# EAGLE schematic nitwhips_v1.0 (EAGLE 5.11)
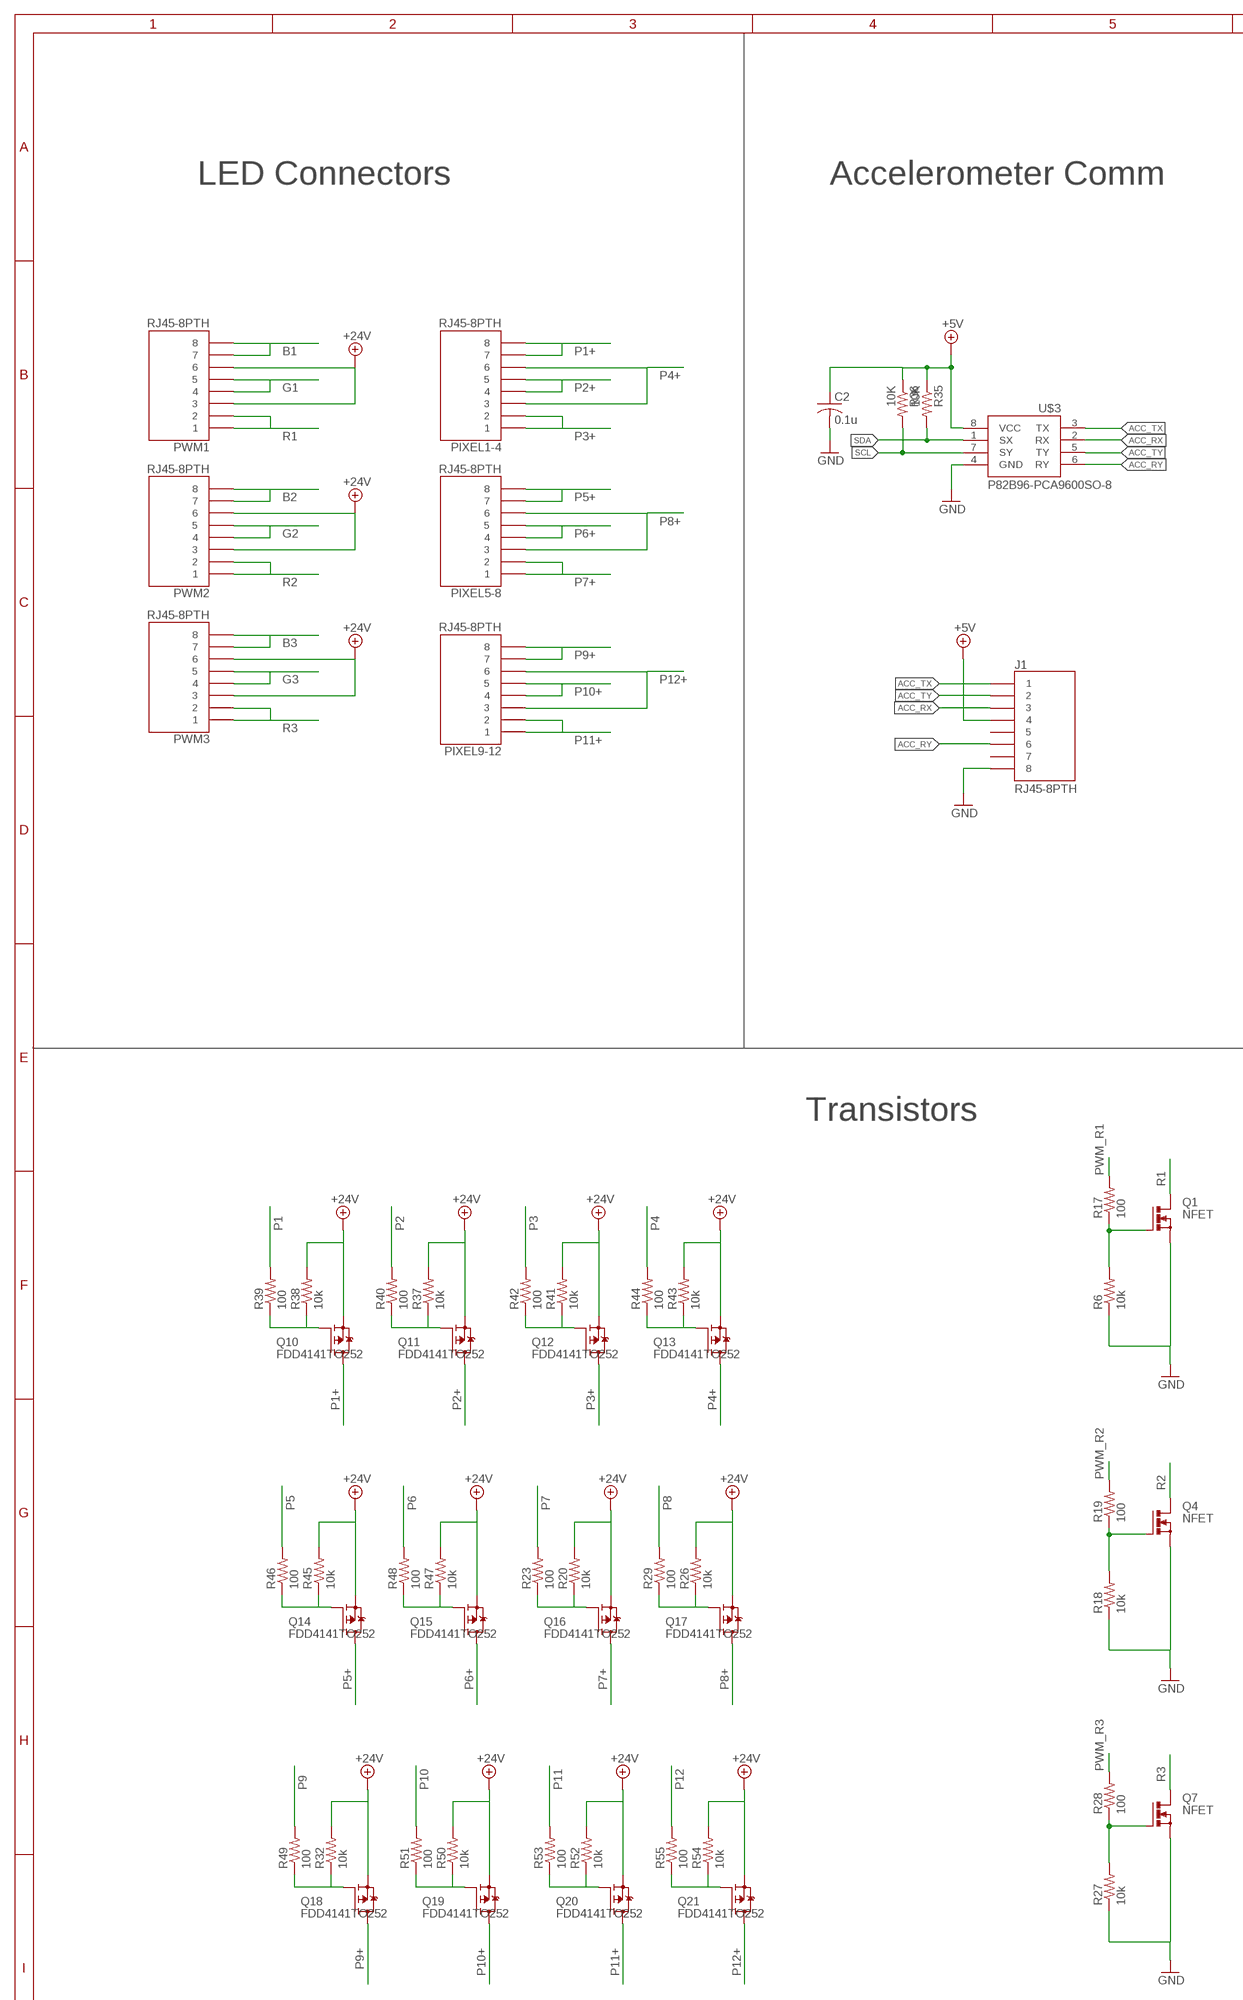
[diagram p0: schematic, sheet 1, part 1 of 2]
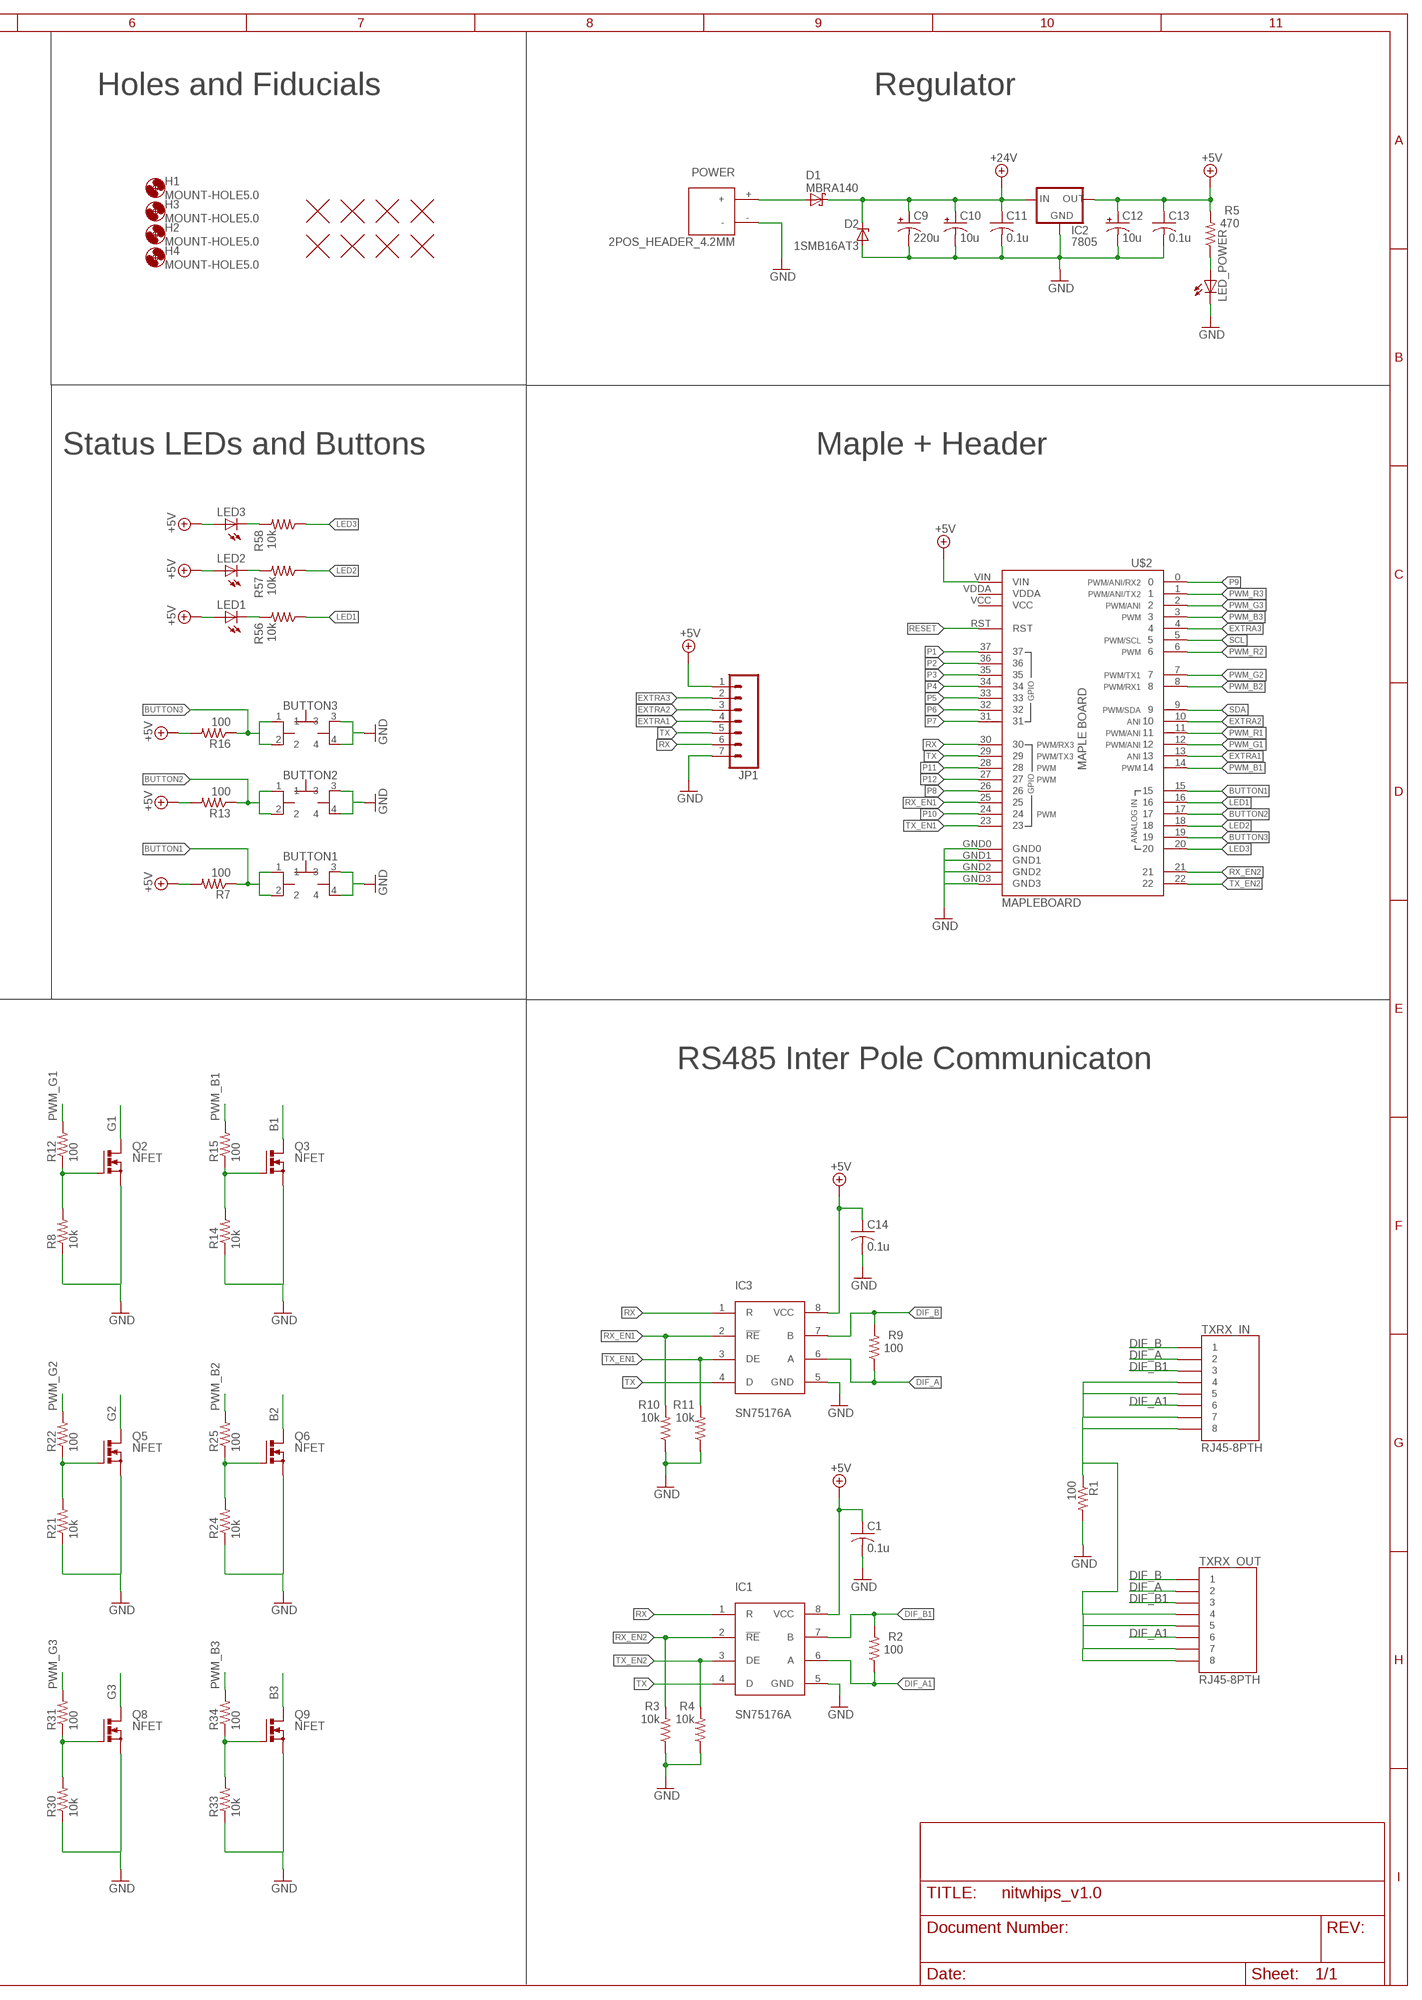
[diagram p1: schematic, sheet 1, part 2 of 2]

## Parts
BUTTON1  TL3301  [TL3301]
BUTTON2  TL3301  [TL3301]
BUTTON3  TL3301  [TL3301]
C1  0.1u  C-USC0805  [C0805]
C2  0.1u  C-USC0805  [C0805]
C9  220u  CPOL-USG  [PANASONIC_G]
C10  10u  CPOL-USCT6032  [CT6032]
C11  0.1u  C-USC0805  [C0805]
C12  10u  CPOL-USCT6032  [CT6032]
C13  0.1u  C-USC0805  [C0805]
C14  0.1u  C-USC0805  [C0805]
D1  MBRA140  [SMA]
D2  1SMB16AT3  ZENER-DIODESMB  [SMB]
H1  MOUNT-HOLE5.0  [5,0]
H2  MOUNT-HOLE5.0  [5,0]
H3  MOUNT-HOLE5.0  [5,0]
H4  MOUNT-HOLE5.0  [5,0]
IC1  SN75176A  [SO-08]
IC2  7805  LP2950CDT-5.0  [DPACK]
IC3  SN75176A  [SO-08]
J1  RJ45-8PTH  [RJ45-8]
JP1  M07  [1X07]
LED1  LEDCHIP-LED0805  [CHIP-LED0805]
LED2  LEDCHIP-LED0805  [CHIP-LED0805]
LED3  LEDCHIP-LED0805  [CHIP-LED0805]
LED_POWER  LEDCHIP-LED0805  [CHIP-LED0805]
PIXEL1-4  RJ45-8PTH  [RJ45-8]
PIXEL5-8  RJ45-8PTH  [RJ45-8]
PIXEL9-12  RJ45-8PTH  [RJ45-8]
POWER  2POS_HEADER_4.2MM  [2POS_HEADER_4.2MM]
PWM1  RJ45-8PTH  [RJ45-8]
PWM2  RJ45-8PTH  [RJ45-8]
PWM3  RJ45-8PTH  [RJ45-8]
Q1  NFET  [TO252]
Q2  NFET  [TO252]
Q3  NFET  [TO252]
Q4  NFET  [TO252]
Q5  NFET  [TO252]
Q6  NFET  [TO252]
Q7  NFET  [TO252]
Q8  NFET  [TO252]
Q9  NFET  [TO252]
Q10  FDD4141TO252  [TO252]
Q11  FDD4141TO252  [TO252]
Q12  FDD4141TO252  [TO252]
Q13  FDD4141TO252  [TO252]
Q14  FDD4141TO252  [TO252]
Q15  FDD4141TO252  [TO252]
Q16  FDD4141TO252  [TO252]
Q17  FDD4141TO252  [TO252]
Q18  FDD4141TO252  [TO252]
Q19  FDD4141TO252  [TO252]
Q20  FDD4141TO252  [TO252]
Q21  FDD4141TO252  [TO252]
R1  100  R-US_R2512  [R2512]
R2  100  R-US_R0805  [R0805]
R3  10k  R-US_R0805  [R0805]
R4  10k  R-US_R0805  [R0805]
R5  470  R-US_R0805  [R0805]
R6  10k  R-US_R0603  [R0603]
R7  100  R-US_R0603  [R0603]
R8  10k  R-US_R0603  [R0603]
R9  100  R-US_R0805  [R0805]
R10  10k  R-US_R0805  [R0805]
R11  10k  R-US_R0805  [R0805]
R12  100  R-US_R0603  [R0603]
R13  100  R-US_R0603  [R0603]
R14  10k  R-US_R0603  [R0603]
R15  100  R-US_R0603  [R0603]
R16  100  R-US_R0603  [R0603]
R17  100  R-US_R0603  [R0603]
R18  10k  R-US_R0603  [R0603]
R19  100  R-US_R0603  [R0603]
R20  10k  R-US_R0603  [R0603]
R21  10k  R-US_R0603  [R0603]
R22  100  R-US_R0603  [R0603]
R23  100  R-US_R0603  [R0603]
R24  10k  R-US_R0603  [R0603]
R25  100  R-US_R0603  [R0603]
R26  10k  R-US_R0603  [R0603]
R27  10k  R-US_R0603  [R0603]
R28  100  R-US_R0603  [R0603]
R29  100  R-US_R0603  [R0603]
R30  10k  R-US_R0603  [R0603]
R31  100  R-US_R0603  [R0603]
R32  10k  R-US_R0603  [R0603]
R33  10k  R-US_R0603  [R0603]
R34  100  R-US_R0603  [R0603]
R35  10K  R-US_R0603  [R0603]
R36  10K  R-US_R0603  [R0603]
R37  10k  R-US_R0603  [R0603]
R38  10k  R-US_R0603  [R0603]
R39  100  R-US_R0603  [R0603]
R40  100  R-US_R0603  [R0603]
R41  10k  R-US_R0603  [R0603]
R42  100  R-US_R0603  [R0603]
R43  10k  R-US_R0603  [R0603]
R44  100  R-US_R0603  [R0603]
R45  10k  R-US_R0603  [R0603]
R46  100  R-US_R0603  [R0603]
R47  10k  R-US_R0603  [R0603]
R48  100  R-US_R0603  [R0603]
R49  100  R-US_R0603  [R0603]
R50  10k  R-US_R0603  [R0603]
R51  100  R-US_R0603  [R0603]
R52  10k  R-US_R0603  [R0603]
R53  100  R-US_R0603  [R0603]
R54  10k  R-US_R0603  [R0603]
R55  100  R-US_R0603  [R0603]
R56  10k  R-US_R0805  [R0805]
R57  10k  R-US_R0805  [R0805]
R58  10k  R-US_R0805  [R0805]
TXRX_IN  RJ45-8PTH  [RJ45-8]
TXRX_OUT  RJ45-8PTH  [RJ45-8]
U$1  FIDUCIAL1X2  [FIDUCIAL-1X2]
U$2  MAPLEBOARD  [MAPLEBOARD]
U$3  P82B96-PCA9600SO-8  [SO-8]
U$4  FIDUCIAL1X2  [FIDUCIAL-1X2]
U$5  FIDUCIAL1X2  [FIDUCIAL-1X2]
U$6  FIDUCIAL1X2  [FIDUCIAL-1X2]
U$7  FIDUCIAL1X2  [FIDUCIAL-1X2]
U$8  FIDUCIAL1X2  [FIDUCIAL-1X2]
U$9  FIDUCIAL1X2  [FIDUCIAL-1X2]
U$10  FIDUCIAL1X2  [FIDUCIAL-1X2]

## Nets
+5V: C1.1 C2.1 C12.+ C13.1 C14.1 IC1.8(VCC) IC2.3(OUT) IC3.8(VCC) J1.4 JP1.1 LED1.A LED2.A LED3.A R5.2 R7.2 R13.2 R16.2 R35.1 R36.1 U$2.VIN U$3.8(VCC)
+24V: C9.+ C10.+ C11.1 D1.K(C) D2.C IC2.1(IN) PWM1.3 PWM1.6 PWM2.3 PWM2.6 PWM3.3 PWM3.6 Q10.S Q11.S Q12.S Q13.S Q14.S Q15.S Q16.S Q17.S Q18.S Q19.S Q20.S Q21.S R20.2 R26.2 R32.2 R37.2 R38.2 R41.2 R43.2 R45.2 R47.2 R50.2 R52.2 R54.2
ACC_RX: J1.3 U$3.2(RX)
ACC_RY: J1.6 U$3.6(RY)
ACC_TX: J1.1 U$3.3(TX)
ACC_TY: J1.2 U$3.5(TY)
B1: PWM1.7 PWM1.8 Q3.2(D)
B2: PWM2.7 PWM2.8 Q6.2(D)
B3: PWM3.7 PWM3.8 Q9.2(D)
BUTTON1: BUTTON1.1 BUTTON1.2 R7.1 U$2.15
BUTTON2: BUTTON2.1 BUTTON2.2 R13.1 U$2.17
BUTTON3: BUTTON3.1 BUTTON3.2 R16.1 U$2.19
DIF_A: IC3.6(A) R9.1 TXRX_IN.2 TXRX_OUT.2
DIF_A1: IC1.6(A) R2.1 TXRX_IN.6 TXRX_OUT.6
DIF_B: IC3.7(B) R9.2 TXRX_IN.1 TXRX_OUT.1
DIF_B1: IC1.7(B) R2.2 TXRX_IN.3 TXRX_OUT.3
EXTRA1: JP1.4 U$2.13
EXTRA2: JP1.3 U$2.10
EXTRA3: JP1.2 U$2.4
G1: PWM1.4 PWM1.5 Q2.2(D)
G2: PWM2.4 PWM2.5 Q5.2(D)
G3: PWM3.4 PWM3.5 Q8.2(D)
GND: BUTTON1.3 BUTTON1.4 BUTTON2.3 BUTTON2.4 BUTTON3.3 BUTTON3.4 C1.2 C2.2 C9.- C10.- C11.2 C12.- C13.2 C14.2 D2.A IC1.5(GND) IC2.4(GND) IC3.5(GND) J1.8 JP1.7 LED_POWER.C POWER.- Q1.3(S) Q2.3(S) Q3.3(S) Q4.3(S) Q5.3(S) Q6.3(S) Q7.3(S) Q8.3(S) Q9.3(S) R1.2 R3.1 R4.1 R6.1 R8.1 R10.1 R11.1 R14.1 R18.1 R21.1 R24.1 R27.1 R30.1 R33.1 U$2.GND0 U$2.GND1 U$2.GND2 U$2.GND3 U$3.4(GND)
LED1: R56.1 U$2.16
LED2: R57.1 U$2.18
LED3: R58.1 U$2.20
N$1: LED_POWER.A R5.1
N$2: Q2.1(G) R8.2 R12.1
N$3: Q18.G R32.1 R49.1
N$4: R1.1 TXRX_IN.4 TXRX_IN.5 TXRX_IN.7 TXRX_IN.8 TXRX_OUT.4 TXRX_OUT.5 TXRX_OUT.7 TXRX_OUT.8
N$5: D1.A POWER.+
N$6: Q19.G R50.1 R51.1
N$8: Q3.1(G) R14.2 R15.1
N$9: Q20.G R52.1 R53.1
N$10: Q4.1(G) R18.2 R19.1
N$11: LED1.C R56.2
N$12: Q5.1(G) R21.2 R22.1
N$13: Q16.G R20.1 R23.1
N$14: Q6.1(G) R24.2 R25.1
N$15: Q17.G R26.1 R29.1
N$16: Q7.1(G) R27.2 R28.1
N$17: Q21.G R54.1 R55.1
N$18: Q8.1(G) R30.2 R31.1
N$19: Q1.1(G) R6.2 R17.1
N$20: LED2.C R57.2
N$21: Q9.1(G) R33.2 R34.1
N$22: Q11.G R37.1 R40.1
N$23: Q12.G R41.1 R42.1
N$24: Q10.G R38.1 R39.1
N$25: Q13.G R43.1 R44.1
N$26: Q14.G R45.1 R46.1
N$27: Q15.G R47.1 R48.1
N$28: LED3.C R58.2
P1: R39.2 U$2.37
P1+: PIXEL1-4.7 PIXEL1-4.8 Q10.D
P2: R40.2 U$2.36
P2+: PIXEL1-4.4 PIXEL1-4.5 Q11.D
P3: R42.2 U$2.35
P3+: PIXEL1-4.1 PIXEL1-4.2 Q12.D
P4: R44.2 U$2.34
P4+: PIXEL1-4.3 PIXEL1-4.6 Q13.D
P5: R46.2 U$2.33
P5+: PIXEL5-8.7 PIXEL5-8.8 Q14.D
P6: R48.2 U$2.32
P6+: PIXEL5-8.4 PIXEL5-8.5 Q15.D
P7: R23.2 U$2.31
P7+: PIXEL5-8.1 PIXEL5-8.2 Q16.D
P8: R29.2 U$2.26
P8+: PIXEL5-8.3 PIXEL5-8.6 Q17.D
P9: R49.2 U$2.0
P9+: PIXEL9-12.7 PIXEL9-12.8 Q18.D
P10: R51.2 U$2.24
P10+: PIXEL9-12.4 PIXEL9-12.5 Q19.D
P11: R53.2 U$2.28
P11+: PIXEL9-12.1 PIXEL9-12.2 Q20.D
P12: R55.2 U$2.27
P12+: PIXEL9-12.3 PIXEL9-12.6 Q21.D
PWM_B1: R15.2 U$2.14
PWM_B2: R25.2 U$2.8
PWM_B3: R34.2 U$2.3
PWM_G1: R12.2 U$2.12
PWM_G2: R22.2 U$2.7
PWM_G3: R31.2 U$2.2
PWM_R1: R17.2 U$2.11
PWM_R2: R19.2 U$2.6
PWM_R3: R28.2 U$2.1
R1: PWM1.1 PWM1.2 Q1.2(D)
R2: PWM2.1 PWM2.2 Q4.2(D)
R3: PWM3.1 PWM3.2 Q7.2(D)
RESET: U$2.RST
RX: IC1.1(R) IC3.1(R) JP1.6 U$2.30
RX_EN1: IC3.2(!RE) R10.2 U$2.25
RX_EN2: IC1.2(!RE) R3.2 U$2.21
SCL: R36.2 U$2.5 U$3.7(SY)
SDA: R35.2 U$2.9 U$3.1(SX)
TX: IC1.4(D) IC3.4(D) JP1.5 U$2.29
TX_EN1: IC3.3(DE) R11.2 U$2.23
TX_EN2: IC1.3(DE) R4.2 U$2.22
Unconnected: J1.5 J1.7 U$2.VCC U$2.VDDA

## Notes on the sheet
- Holes and Fiducials | Regulator
- LED Connectors | Accelerometer Comm
- Status LEDs and Buttons | Maple + Header
- Transistors | RS485 Inter Pole Communicaton

## Library data of the parts
BUTTON1-BUTTON3 = E-switch:TL3301
C1 C2 C11 C13 C14 = rcl:C-US: CAPACITOR, American symbol
C9 C10 C12 = rcl:CPOL-US: POLARIZED CAPACITOR, American symbol
D1 = diode:MBRA140
D2 = diode:ZENER-DIODE: Z-Diode
H1-H4 = holes:MOUNT-HOLE: MOUNTING HOLE with drill center marker
IC1 IC3 = texas:SN75176A: Transceiver RS422
IC2 = v-reg:LP2950?*: Source: http://cache.national.com/ds/LP/LP2950.pdf
J1 PIXEL1-4 PIXEL5-8 PIXEL9-12 PWM1-PWM3 TXRX_IN TXRX_OUT = SparkFun:RJ45-8: RJ45 Jack Simple RJ45, 8-pin connection - connector for common Cat5, Cat5e, and Cat6 Ethernet cables. Footprint not yet proven in production. Connector sku is PRT-00643; Breakout PCB sku is BOB-00716.
JP1 = SparkFun:M07: Header 7 Standard 7-pin 0.1" header. Use with straight break away headers (SKU : PRT-00116), right angle break away headers (PRT-00553), swiss pins (PRT-00743), machine pins (PRT-00117), and female headers (PRT-00115). NOTES ON THE VARIANTS LOCK and LOCK_LONGPADS... This footprint was designed to help hold the alignment of a through-hole component (i.e. 7-pin header) while soldering it into place. You may notice that each hole has been shifted either up or down by 0.005 of an inch from it's more standard position (which is usually a perfectly straight line). This slight alteration caused the pins (the squares in the middle) to touch the edges of the holes. Because they are alternating, it causes a "brace" to hold the header in place. 0.005 has proven to be the perfect amount of "off-center" position when using our standard breakaway headers. Although looks a little odd when you look at the bare footprint, once you have a header in there, the alteration is very hard to notice. Also, if you push a header all the way into place, it is covered up entirely on the bottom side. This idea of altering the position of holes to aid alignment will be further integrated into the Sparkfun Library for other footprints. It can help hold any component with 3 or more connection pins.
LED1-LED3 LED_POWER = led:LED: LED OSRAM: - CHIPLED LG R971, LG N971, LY N971, LG Q971, LY Q971, LO R971, LY R971 LH N974, LH R974 LS Q976, LO Q976, LY Q976 LO Q996 - Hyper CHIPLED LW Q18S LB Q993, LB Q99A, LB R99A - SideLED LS A670, LO A670, LY A670, LG A670, LP A670 LB A673, LV A673, LT A673, LW A673 LH A674 LY A675 LS A676, LA A676, LO A676, LY A676, LW A676 LS A679, LY A679, LG A679 - Hyper Micro SIDELED® LS Y876, LA Y876, LO Y876, LY Y876 LT Y87S - SmartLED LW L88C, LW L88S LB L89C, LB L89S, LG L890 LS L89K, LO L89K, LY L89K LS L896, LA L896, LO L896, LY L896 - TOPLED LS T670, LO T670, LY T670, LG T670, LP T670 LSG T670, LSP T670, LSY T670, LOP T670, LYG T670 LG T671, LOG T671, LSG T671 LB T673, LV T673, LT T673, LW T673 LH T674 LS T676, LA T676, LO T676, LY T676, LB T676, LH T676, LSB T676, LW T676 LB T67C, LV T67C, LT T67C, LS T67K, LO T67K, LY T67K, LW E67C LS E67B, LA E67B, LO E67B, LY E67B, LB E67C, LV E67C, LT E67C LW T67C LS T679, LY T679, LG T679 LS T770, LO T770, LY T770, LG T770, LP T770 LB T773, LV T773, LT T773, LW T773 LH T774 LS E675, LA E675, LY E675, LS T675 LS T776, LA T776, LO T776, LY T776, LB T776 LHGB T686 LT T68C, LB T68C - Hyper Mini TOPLED® LB M676 - Mini TOPLED Santana® LG M470 LS M47K, LO M47K, LY M47K Source: http://www.osram.convergy.de LUXEON: - LUMILED® LXK2-PW12-R00, LXK2-PW12-S00, LXK2-PW14-U00, LXK2-PW14-V00 LXK2-PM12-R00, LXK2-PM12-S00, LXK2-PM14-U00 LXK2-PE12-Q00, LXK2-PE12-R00, LXK2-PE12-S00, LXK2-PE14-T00, LXK2-PE14-U00 LXK2-PB12-K00, LXK2-PB12-L00, LXK2-PB12-M00, LXK2-PB14-N00, LXK2-PB14-P00, LXK2-PB14-Q00 LXK2-PR12-L00, LXK2-PR12-M00, LXK2-PR14-Q00, LXK2-PR14-R00 LXK2-PD12-Q00, LXK2-PD12-R00, LXK2-PD12-S00 LXK2-PH12-R00, LXK2-PH12-S00 LXK2-PL12-P00, LXK2-PL12-Q00, LXK2-PL12-R00 Source: www.luxeon.com KINGBRIGHT: KA-3528ASYC Source: www.kingbright.com
POWER = vadim:2POS_HEADER_4.2MM
Q1-Q9 = vincent:NFET
Q10-Q21 = transistor-fet:FDD4141: P-Channel PowerTrench® MOSFET Source: FDD4141.pdf
R1-R58 = rcl:R-US_: RESISTOR, American symbol
U$1 U$4-U$10 = SparkFunEagle-6-6-07:FIDUCIAL: Fiducial Alignment Points Various fiducial points for machine vision alignment.
U$2 = NITWHIPS:MAPLEBOARD
U$3 = Sparky:P82B96-PCA9600: P822B96 and PCA9600, bipolar IC creating a non-latching, bidirectional, logic interface between the normal I2C bus and a range of other bus configuration icluding rs485.